# EAGLE design xen_matrix_controls_6x6 (EAGLE 9.6.0)
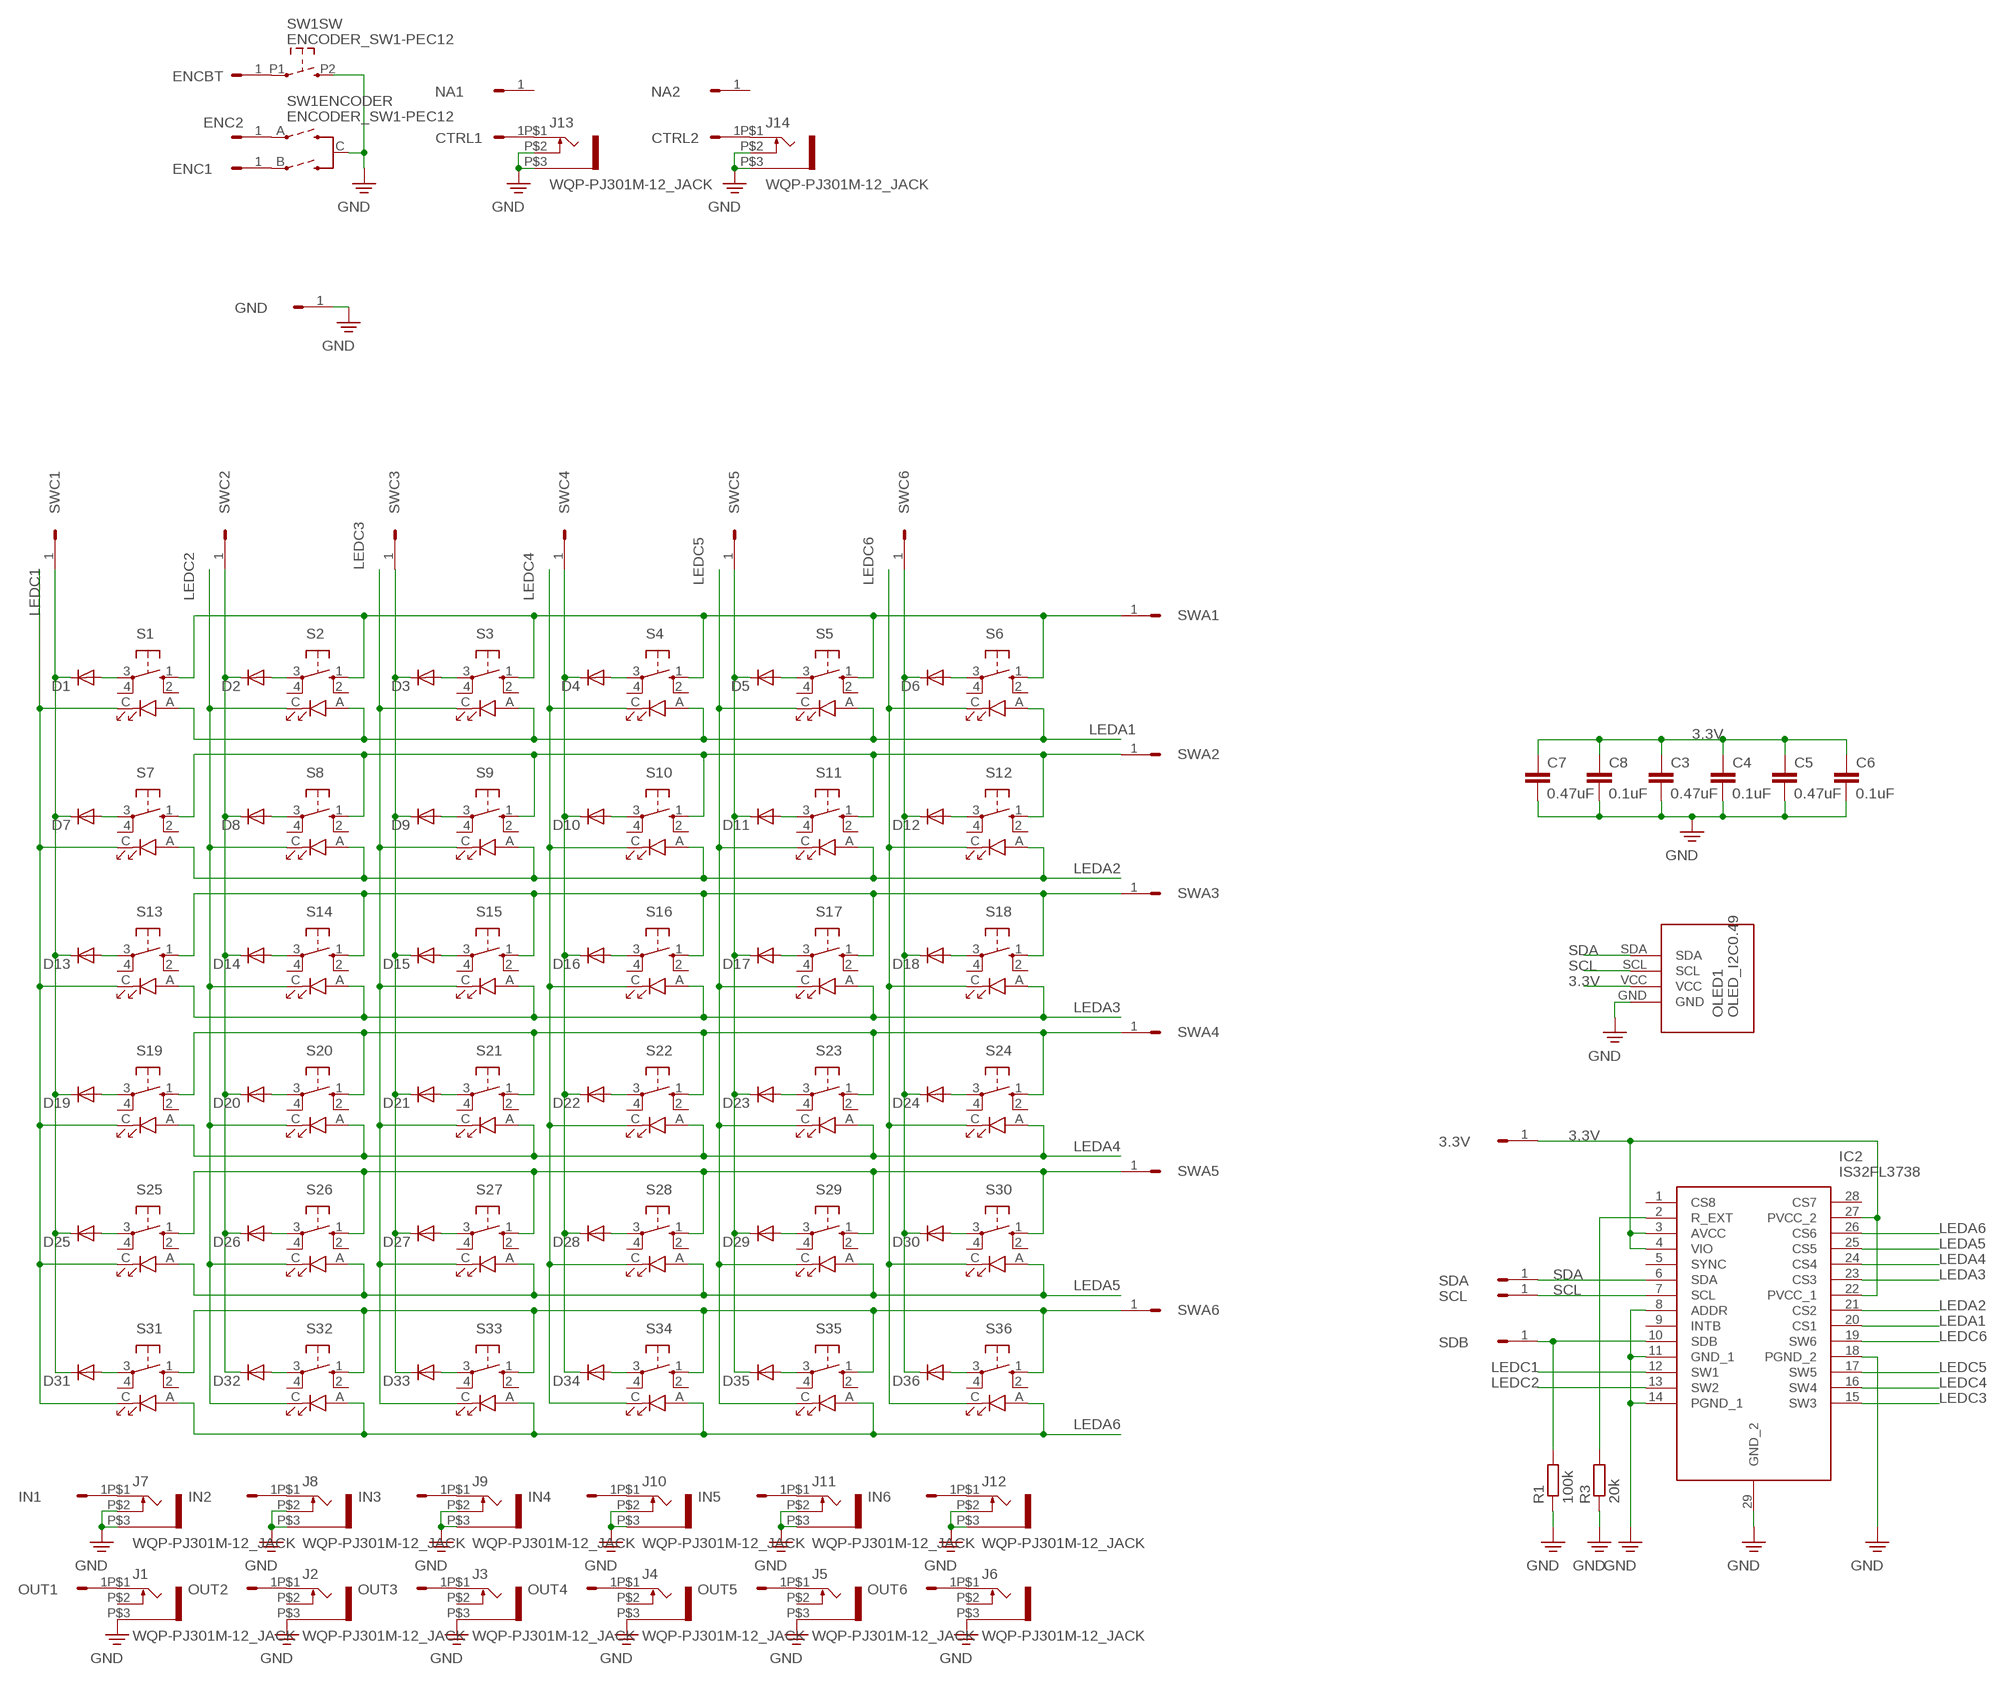
[diagram p0: schematic, sheet 1]

## Parts
3.3V  HEADER/MALE/01  [HEADER/MALE/01]
C3  0.47uF  CAPACITORC0603  [C0603]
C4  0.1uF  CAPACITORC0603  [C0603]
C5  0.47uF  CAPACITORC0603  [C0603]
C6  0.1uF  CAPACITORC0603  [C0603]
C7  0.47uF  CAPACITORC0603  [C0603]
C8  0.1uF  CAPACITORC0603  [C0603]
CTRL1  HEADER/MALE/01  [HEADER/MALE/01]
CTRL2  HEADER/MALE/01  [HEADER/MALE/01]
D1  1N4148SOD-123  [SOD-123]
D2  1N4148SOD-123  [SOD-123]
D3  1N4148SOD-123  [SOD-123]
D4  1N4148SOD-123  [SOD-123]
D5  1N4148SOD-123  [SOD-123]
D6  1N4148SOD-123  [SOD-123]
D7  1N4148SOD-123  [SOD-123]
D8  1N4148SOD-123  [SOD-123]
D9  1N4148SOD-123  [SOD-123]
D10  1N4148SOD-123  [SOD-123]
D11  1N4148SOD-123  [SOD-123]
D12  1N4148SOD-123  [SOD-123]
D13  1N4148SOD-123  [SOD-123]
D14  1N4148SOD-123  [SOD-123]
D15  1N4148SOD-123  [SOD-123]
D16  1N4148SOD-123  [SOD-123]
D17  1N4148SOD-123  [SOD-123]
D18  1N4148SOD-123  [SOD-123]
D19  1N4148SOD-123  [SOD-123]
D20  1N4148SOD-123  [SOD-123]
D21  1N4148SOD-123  [SOD-123]
D22  1N4148SOD-123  [SOD-123]
D23  1N4148SOD-123  [SOD-123]
D24  1N4148SOD-123  [SOD-123]
D25  1N4148SOD-123  [SOD-123]
D26  1N4148SOD-123  [SOD-123]
D27  1N4148SOD-123  [SOD-123]
D28  1N4148SOD-123  [SOD-123]
D29  1N4148SOD-123  [SOD-123]
D30  1N4148SOD-123  [SOD-123]
D31  1N4148SOD-123  [SOD-123]
D32  1N4148SOD-123  [SOD-123]
D33  1N4148SOD-123  [SOD-123]
D34  1N4148SOD-123  [SOD-123]
D35  1N4148SOD-123  [SOD-123]
D36  1N4148SOD-123  [SOD-123]
ENC1  HEADER/MALE/01  [HEADER/MALE/01]
ENC2  HEADER/MALE/01  [HEADER/MALE/01]
ENCBT  HEADER/MALE/01  [HEADER/MALE/01]
GND  HEADER/MALE/01  [HEADER/MALE/01]
IC2  IS32FL3738  [TSSOP29]
IN1  HEADER/MALE/01  [HEADER/MALE/01]
IN2  HEADER/MALE/01  [HEADER/MALE/01]
IN3  HEADER/MALE/01  [HEADER/MALE/01]
IN4  HEADER/MALE/01  [HEADER/MALE/01]
IN5  HEADER/MALE/01  [HEADER/MALE/01]
IN6  HEADER/MALE/01  [HEADER/MALE/01]
J1  WQP-PJ301M-12_JACK  [WQP-PJ301M-12_JACK]
J2  WQP-PJ301M-12_JACK  [WQP-PJ301M-12_JACK]
J3  WQP-PJ301M-12_JACK  [WQP-PJ301M-12_JACK]
J4  WQP-PJ301M-12_JACK  [WQP-PJ301M-12_JACK]
J5  WQP-PJ301M-12_JACK  [WQP-PJ301M-12_JACK]
J6  WQP-PJ301M-12_JACK  [WQP-PJ301M-12_JACK]
J7  WQP-PJ301M-12_JACK  [WQP-PJ301M-12_JACK]
J8  WQP-PJ301M-12_JACK  [WQP-PJ301M-12_JACK]
J9  WQP-PJ301M-12_JACK  [WQP-PJ301M-12_JACK]
J10  WQP-PJ301M-12_JACK  [WQP-PJ301M-12_JACK]
J11  WQP-PJ301M-12_JACK  [WQP-PJ301M-12_JACK]
J12  WQP-PJ301M-12_JACK  [WQP-PJ301M-12_JACK]
J13  WQP-PJ301M-12_JACK  [WQP-PJ301M-12_JACK]
J14  WQP-PJ301M-12_JACK  [WQP-PJ301M-12_JACK]
NA1  HEADER/MALE/01  [HEADER/MALE/01]
NA2  HEADER/MALE/01  [HEADER/MALE/01]
OLED1  OLED_I2C0.49  [OLEDM0.49]
OUT1  HEADER/MALE/01  [HEADER/MALE/01]
OUT2  HEADER/MALE/01  [HEADER/MALE/01]
OUT3  HEADER/MALE/01  [HEADER/MALE/01]
OUT4  HEADER/MALE/01  [HEADER/MALE/01]
OUT5  HEADER/MALE/01  [HEADER/MALE/01]
OUT6  HEADER/MALE/01  [HEADER/MALE/01]
R1  100k  RESISTOR  [R0603]
R3  20k  RESISTOR  [R0603]
S1  SW-LEDTHONK  [SW-PUSH-TACT-LED-THONK]
S2  SW-LEDTHONK  [SW-PUSH-TACT-LED-THONK]
S3  SW-LEDTHONK  [SW-PUSH-TACT-LED-THONK]
S4  SW-LEDTHONK  [SW-PUSH-TACT-LED-THONK]
S5  SW-LEDTHONK  [SW-PUSH-TACT-LED-THONK]
S6  SW-LEDTHONK  [SW-PUSH-TACT-LED-THONK]
S7  SW-LEDTHONK  [SW-PUSH-TACT-LED-THONK]
S8  SW-LEDTHONK  [SW-PUSH-TACT-LED-THONK]
S9  SW-LEDTHONK  [SW-PUSH-TACT-LED-THONK]
S10  SW-LEDTHONK  [SW-PUSH-TACT-LED-THONK]
S11  SW-LEDTHONK  [SW-PUSH-TACT-LED-THONK]
S12  SW-LEDTHONK  [SW-PUSH-TACT-LED-THONK]
S13  SW-LEDTHONK  [SW-PUSH-TACT-LED-THONK]
S14  SW-LEDTHONK  [SW-PUSH-TACT-LED-THONK]
S15  SW-LEDTHONK  [SW-PUSH-TACT-LED-THONK]
S16  SW-LEDTHONK  [SW-PUSH-TACT-LED-THONK]
S17  SW-LEDTHONK  [SW-PUSH-TACT-LED-THONK]
S18  SW-LEDTHONK  [SW-PUSH-TACT-LED-THONK]
S19  SW-LEDTHONK  [SW-PUSH-TACT-LED-THONK]
S20  SW-LEDTHONK  [SW-PUSH-TACT-LED-THONK]
S21  SW-LEDTHONK  [SW-PUSH-TACT-LED-THONK]
S22  SW-LEDTHONK  [SW-PUSH-TACT-LED-THONK]
S23  SW-LEDTHONK  [SW-PUSH-TACT-LED-THONK]
S24  SW-LEDTHONK  [SW-PUSH-TACT-LED-THONK]
S25  SW-LEDTHONK  [SW-PUSH-TACT-LED-THONK]
S26  SW-LEDTHONK  [SW-PUSH-TACT-LED-THONK]
S27  SW-LEDTHONK  [SW-PUSH-TACT-LED-THONK]
S28  SW-LEDTHONK  [SW-PUSH-TACT-LED-THONK]
S29  SW-LEDTHONK  [SW-PUSH-TACT-LED-THONK]
S30  SW-LEDTHONK  [SW-PUSH-TACT-LED-THONK]
S31  SW-LEDTHONK  [SW-PUSH-TACT-LED-THONK]
S32  SW-LEDTHONK  [SW-PUSH-TACT-LED-THONK]
S33  SW-LEDTHONK  [SW-PUSH-TACT-LED-THONK]
S34  SW-LEDTHONK  [SW-PUSH-TACT-LED-THONK]
S35  SW-LEDTHONK  [SW-PUSH-TACT-LED-THONK]
S36  SW-LEDTHONK  [SW-PUSH-TACT-LED-THONK]
SCL  HEADER/MALE/01  [HEADER/MALE/01]
SDA  HEADER/MALE/01  [HEADER/MALE/01]
SDB  HEADER/MALE/01  [HEADER/MALE/01]
SW1  ENCODER_SW1-PEC12  [PEC12_INCREMENTAL_ENCODER]
SWA1  HEADER/MALE/01  [HEADER/MALE/01]
SWA2  HEADER/MALE/01  [HEADER/MALE/01]
SWA3  HEADER/MALE/01  [HEADER/MALE/01]
SWA4  HEADER/MALE/01  [HEADER/MALE/01]
SWA5  HEADER/MALE/01  [HEADER/MALE/01]
SWA6  HEADER/MALE/01  [HEADER/MALE/01]
SWC1  HEADER/MALE/01  [HEADER/MALE/01]
SWC2  HEADER/MALE/01  [HEADER/MALE/01]
SWC3  HEADER/MALE/01  [HEADER/MALE/01]
SWC4  HEADER/MALE/01  [HEADER/MALE/01]
SWC5  HEADER/MALE/01  [HEADER/MALE/01]
SWC6  HEADER/MALE/01  [HEADER/MALE/01]

## Nets
3.3V: 3.3V.1 C3.1 C4.1 C5.1 C6.1 C7.1 C8.1 IC2.3(AVCC) IC2.4(VIO) IC2.22(PVCC_1) IC2.27(PVCC_2) OLED1.VCC
LEDA1: IC2.20(CS1) S1.A S2.A S3.A S4.A S5.A S6.A
LEDA2: IC2.21(CS2) S7.A S8.A S9.A S10.A S11.A S12.A
LEDA3: IC2.23(CS3) S13.A S14.A S15.A S16.A S17.A S18.A
LEDA4: IC2.24(CS4) S19.A S20.A S21.A S22.A S23.A S24.A
LEDA5: IC2.25(CS5) S25.A S26.A S27.A S28.A S29.A S30.A
LEDA6: IC2.26(CS6) S31.A S32.A S33.A S34.A S35.A S36.A
LEDC1: IC2.12(SW1) S1.C S7.C S13.C S19.C S25.C S31.C
LEDC2: IC2.13(SW2) S2.C S8.C S14.C S20.C S26.C S32.C
LEDC3: IC2.15(SW3) S3.C S9.C S15.C S21.C S27.C S33.C
LEDC4: IC2.16(SW4) S4.C S10.C S16.C S22.C S28.C S34.C
LEDC5: IC2.17(SW5) S5.C S11.C S17.C S23.C S29.C S35.C
LEDC6: IC2.19(SW6) S6.C S12.C S18.C S24.C S30.C S36.C
N$3: IC2.10(SDB) R1.2 SDB.1
N$6: IC2.2(R_EXT) R3.2
N$13: S25.1(S) S26.1(S) S27.1(S) S28.1(S) S29.1(S) S30.1(S) SWA5.1
N$14: S1.1(S) S2.1(S) S3.1(S) S4.1(S) S5.1(S) S6.1(S) SWA1.1
N$15: D1.A S1.3(P)
N$16: S7.1(S) S8.1(S) S9.1(S) S10.1(S) S11.1(S) S12.1(S) SWA2.1
N$17: D4.A S4.3(P)
N$18: D5.A S5.3(P)
N$19: S13.1(S) S14.1(S) S15.1(S) S16.1(S) S17.1(S) S18.1(S) SWA3.1
N$20: S19.1(S) S20.1(S) S21.1(S) S22.1(S) S23.1(S) S24.1(S) SWA4.1
N$21: D6.A S6.3(P)
N$22: S31.1(S) S32.1(S) S33.1(S) S34.1(S) S35.1(S) S36.1(S) SWA6.1
N$23: D7.A S7.3(P)
N$24: D8.A S8.3(P)
N$25: D9.A S9.3(P)
N$26: D10.A S10.3(P)
N$27: D11.A S11.3(P)
N$28: D12.A S12.3(P)
N$29: D13.A S13.3(P)
N$30: D14.A S14.3(P)
N$31: D15.A S15.3(P)
N$32: D16.A S16.3(P)
N$33: D17.A S17.3(P)
N$34: D18.A S18.3(P)
N$35: D19.A S19.3(P)
N$36: D20.A S20.3(P)
N$37: D21.A S21.3(P)
N$38: D22.A S22.3(P)
N$39: D23.A S23.3(P)
N$40: D24.A S24.3(P)
N$41: D25.A S25.3(P)
N$42: D26.A S26.3(P)
N$43: D27.A S27.3(P)
N$44: D28.A S28.3(P)
N$45: D29.A S29.3(P)
N$46: D30.A S30.3(P)
N$47: D31.A S31.3(P)
N$48: D32.A S32.3(P)
N$49: D33.A S33.3(P)
N$50: D34.A S34.3(P)
N$51: D35.A S35.3(P)
N$52: D36.A S36.3(P)
N$53: D2.A S2.3(P)
N$54: D3.A S3.3(P)
N$55: D1.C D7.C D13.C D19.C D25.C D31.C SWC1.1
N$56: D2.C D8.C D14.C D20.C D26.C D32.C SWC2.1
N$57: D3.C D9.C D15.C D21.C D27.C D33.C SWC3.1
N$58: D4.C D10.C D16.C D22.C D28.C D34.C SWC4.1
N$59: D5.C D11.C D17.C D23.C D29.C D35.C SWC5.1
N$60: D6.C D12.C D18.C D24.C D30.C D36.C SWC6.1
N$61: J2.P$1 OUT2.1
N$62: J1.P$1 OUT1.1
N$63: J3.P$1 OUT3.1
N$64: J4.P$1 OUT4.1
N$65: J5.P$1 OUT5.1
N$66: J6.P$1 OUT6.1
N$67: ENC2.1 SW1.A(ENCODER:A)
N$68: IN1.1 J7.P$1
N$69: IN2.1 J8.P$1
N$70: IN3.1 J9.P$1
N$71: IN4.1 J10.P$1
N$72: IN5.1 J11.P$1
N$73: IN6.1 J12.P$1
N$74: CTRL1.1 J13.P$1
N$75: CTRL2.1 J14.P$1
N$76: ENC1.1 SW1.B(ENCODER:B)
N$78: ENCBT.1 SW1.P1
PE: C3.2 C4.2 C5.2 C6.2 C7.2 C8.2 GND.1 IC2.8(ADDR) IC2.11(GND_1) IC2.14(PGND_1) IC2.18(PGND_2) IC2.29(GND_2) J1.P$3 J2.P$3 J3.P$3 J4.P$3 J5.P$3 J6.P$3 J7.P$2 J7.P$3 J8.P$2 J8.P$3 J9.P$2 J9.P$3 J10.P$2 J10.P$3 J11.P$2 J11.P$3 J12.P$2 J12.P$3 J13.P$2 J13.P$3 J14.P$2 J14.P$3 OLED1.GND R1.1 R3.1 SW1.C(ENCODER:C) SW1.P2 ; supply symbol labelled GND
SCL: IC2.7(SCL) OLED1.SCL SCL.1
SDA: IC2.6(SDA) OLED1.SDA SDA.1
Unconnected: IC2.1(CS8) IC2.5(SYNC) IC2.9(INTB) IC2.28(CS7) J1.P$2 J2.P$2 J3.P$2 J4.P$2 J5.P$2 J6.P$2 NA1.1 NA2.1 S1.2(S1) S1.4(P1) S2.2(S1) S2.4(P1) S3.2(S1) S3.4(P1) S4.2(S1) S4.4(P1) S5.2(S1) S5.4(P1) S6.2(S1) S6.4(P1) S7.2(S1) S7.4(P1) S8.2(S1) S8.4(P1) S9.2(S1) S9.4(P1) S10.2(S1) S10.4(P1) S11.2(S1) S11.4(P1) S12.2(S1) S12.4(P1) S13.2(S1) S13.4(P1) S14.2(S1) S14.4(P1) S15.2(S1) S15.4(P1) S16.2(S1) S16.4(P1) S17.2(S1) S17.4(P1) S18.2(S1) S18.4(P1) S19.2(S1) S19.4(P1) S20.2(S1) S20.4(P1) S21.2(S1) S21.4(P1) S22.2(S1) S22.4(P1) S23.2(S1) S23.4(P1) S24.2(S1) S24.4(P1) S25.2(S1) S25.4(P1) S26.2(S1) S26.4(P1) S27.2(S1) S27.4(P1) S28.2(S1) S28.4(P1) S29.2(S1) S29.4(P1) S30.2(S1) S30.4(P1) S31.2(S1) S31.4(P1) S32.2(S1) S32.4(P1) S33.2(S1) S33.4(P1) S34.2(S1) S34.4(P1) S35.2(S1) S35.4(P1) S36.2(S1) S36.4(P1)

## Library data of the parts
3.3V CTRL1 CTRL2 ENC1 ENC2 ENCBT GND IN1-IN6 NA1 NA2 OUT1-OUT6 SCL SDA SDB SWA1-SWA6 SWC1-SWC6 = connectors:HEADER/MALE/01; SPICEPREFIX: X
C3-C8 = capacitors:CAPACITOR: CAPACITOR, European symbol
D1-D36 = transistors:1N4148: DIODE high speed (Philips)
IC2 = ic_digital:IS32FL3738: IC LED DRIVER 6X8 28TSSOP Source: Datasheet <http://www.issi.com/WW/pdf/IS32FL3738.pdf>; DESCRIPTION: IC LED DRIVER 6X8 28TSSOP; HEIGHT: 1.2mm; MANUFACTURER_NAME: ISSI, Integrated Silicon Solution Inc; MANUFACTURER_PART_NUMBER: IS32FL3738-ZLA3-TR
J1-J14 = controls:WQP-PJ301M-12_JACK
OLED1 = display:OLED_I2C
R1 R3 = resistors:RESISTOR: RESISTOR, European symbol
S1-S36 = controls:SW-LED: Illuminated Switch
SW1 = controls:ENCODER_SW1: Incremental Encoder with push switch

## Board
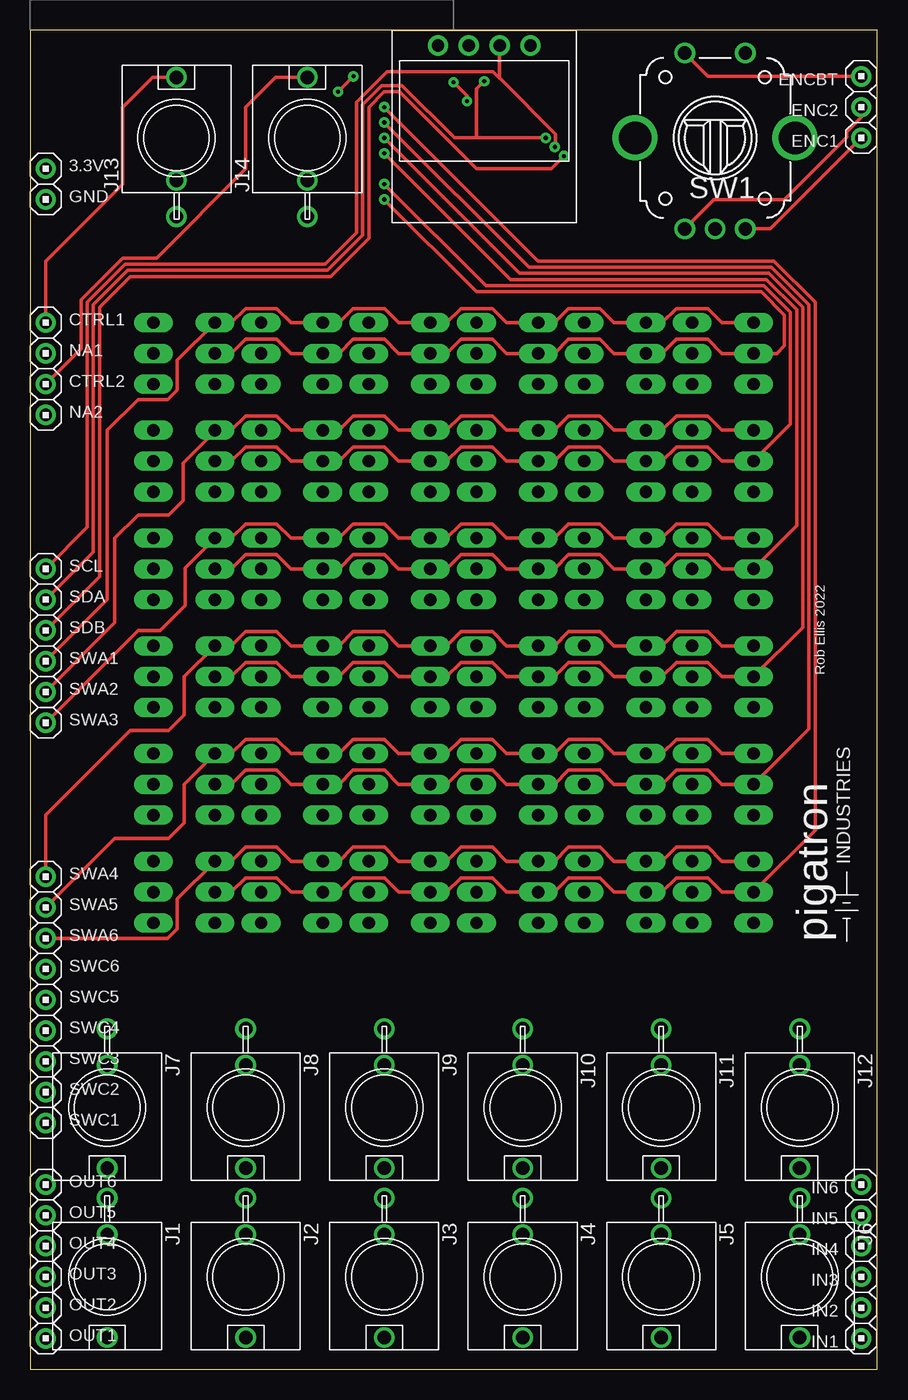
[diagram p1: board, top side]
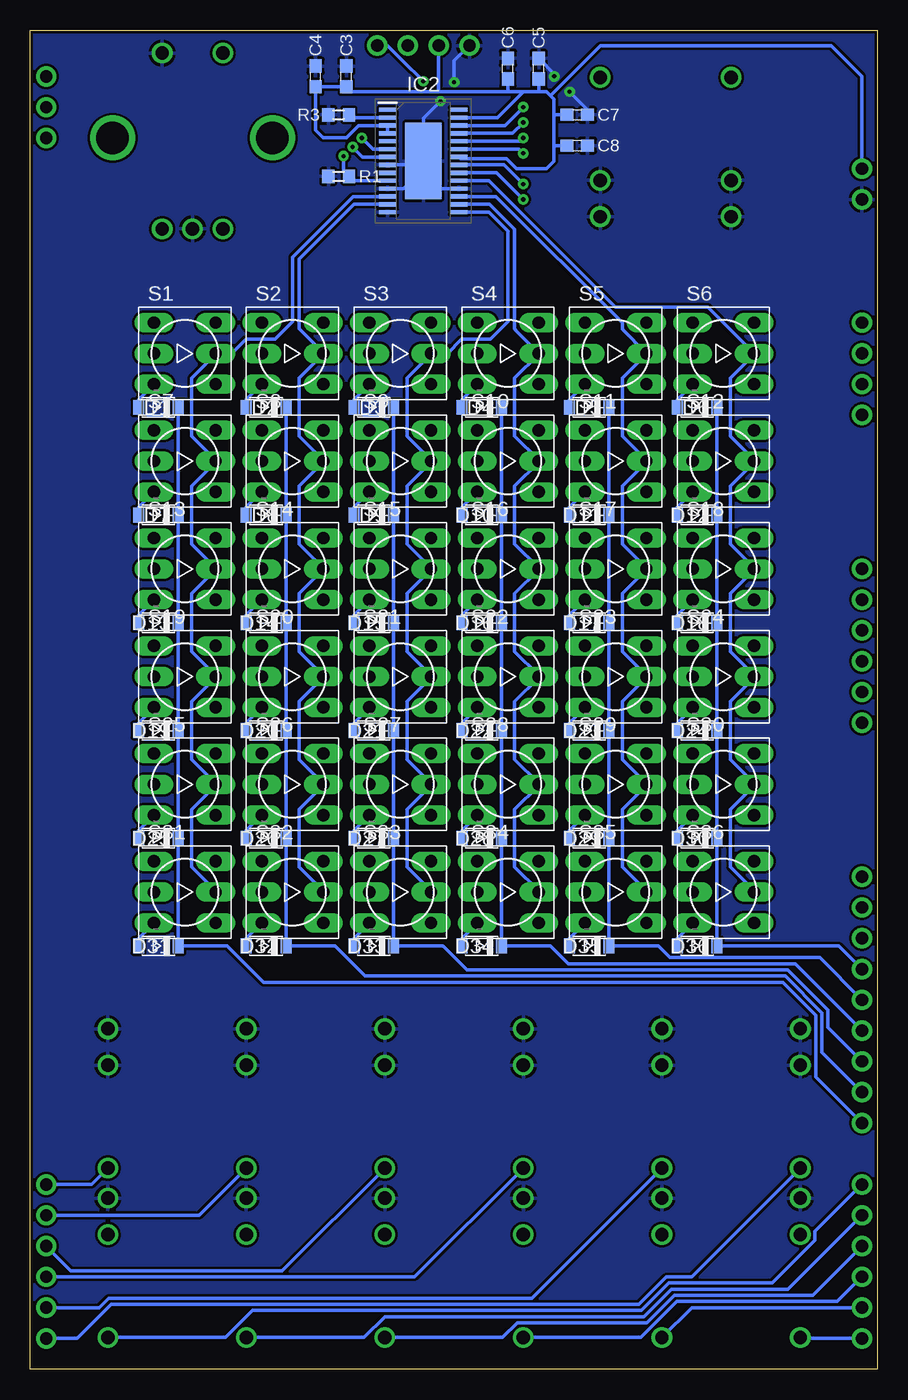
[diagram p2: board, bottom side, seen from below]

Size 69.9 x 110.48 mm. Coordinates in mm from the lower left corner, seen from the top.
Outline: 0,0 69.9,0 69.9,110.48 0,110.48 0,0
Copper layers (1*16): Top 0.0356mm / dielectric 1.5011mm / Bottom 0.0356mm
Design rules "pigatron *": minimum track width 8mil, minimum drill 13mil, track to track 8mil, track to pad 8mil, pad to pad 8mil, via to via 8mil, smd to smd 6mil, copper to edge 10mil, drill to drill 10mil, minimum pad ring 12mil, minimum via ring 10mil, stop-mask expansion 4mil, vias tented up to drill 0mil, thermal gap 10mil

### Footprints (pad centres in the part's own frame; a part is rotated, then mirrored left to right if it is on the bottom)
HEADER/MALE/01 = drill 1.016 pad 1.676: 1 0,0
C0603 = smd 1.1 x 1: 1 -0.85,0; 2 0.85,0
SOD-123 = smd 0.91 x 1.22: A 1.635,0; C -1.635,0
TSSOP29 = smd 1.4 x 0.35: 1 -2.938,4.225; 2 -2.938,3.575; 3 -2.938,2.925; 4 -2.938,2.275; 5 -2.938,1.625; 6 -2.938,0.975; 7 -2.938,0.325; 8 -2.938,-0.325; 9 -2.938,-0.975; 10 -2.938,-1.625; 11 -2.938,-2.275; 12 -2.938,-2.925; 13 -2.938,-3.575; 14 -2.938,-4.225; 15 2.938,-4.225; 16 2.938,-3.575; 17 2.938,-2.925; 18 2.938,-2.275; 19 2.938,-1.625; 20 2.938,-0.975; 21 2.938,-0.325; 22 2.938,0.325; 23 2.938,0.975; 24 2.938,1.625; 25 2.938,2.275; 26 2.938,2.925; 27 2.938,3.575; 28 2.938,4.225 | smd 3 x 6.3: 29 0,0
WQP-PJ301M-12_JACK = drill 1.1 pad 1.676: P$1 0,5; P$2 0,-3.5; P$3 0,-6.5
OLEDM0.49 = drill 1.016 pad 1.676: GND -3.81,-1.27; SCL 1.27,-1.27; SDA 3.81,-1.27; VCC -1.27,-1.27
R0603 = smd 1 x 1.1: 1 -0.85,0; 2 0.85,0
SW-PUSH-TACT-LED-THONK = drill 1.016 long: 1 -2.54,2.54; 2 2.54,2.54; 3 -2.54,-2.54; 4 2.54,-2.54; A -2.54,0; C 2.54,0
PEC12_INCREMENTAL_ENCODER = drill 1.1 pad 1.676: A -2.5,-7.5; B 2.5,-7.5; C 0,-7.5; P1 -2.5,7; P2 2.5,7 | drill 2.692: GND@1 -6.6,0; GND@2 6.6,0

### Placement (x,y rotation side)
3.3V  1.27,99.06 0 top
C3  43.81,106.68 90 bottom
C4  46.35,106.68 90 bottom
C5  27.94,107.31 90 bottom
C6  30.48,107.31 90 bottom
C7  24.77,103.5 0 bottom
C8  24.77,100.97 0 bottom
CTRL1  1.27,86.36 0 top
CTRL2  1.27,81.28 0 top
D1  59.33,79.38 180 bottom
D2  50.44,79.38 180 bottom
D3  41.55,79.38 180 bottom
D4  32.66,79.38 180 bottom
D5  23.77,79.38 180 bottom
D6  14.88,79.38 180 bottom
D7  59.33,70.48 180 bottom
D8  50.44,70.48 180 bottom
D9  41.55,70.48 180 bottom
D10  32.66,70.48 180 bottom
D11  23.77,70.48 180 bottom
D12  14.88,70.48 180 bottom
D13  59.33,61.59 180 bottom
D14  50.44,61.59 180 bottom
D15  41.55,61.59 180 bottom
D16  32.66,61.59 180 bottom
D17  23.77,61.59 180 bottom
D18  14.88,61.59 180 bottom
D19  59.33,52.7 180 bottom
D20  50.44,52.7 180 bottom
D21  41.55,52.7 180 bottom
D22  32.66,52.7 180 bottom
D23  23.77,52.7 180 bottom
D24  14.88,52.7 180 bottom
D25  59.33,43.81 180 bottom
D26  50.44,43.81 180 bottom
D27  41.55,43.81 180 bottom
D28  32.66,43.81 180 bottom
D29  23.77,43.81 180 bottom
D30  14.88,43.81 180 bottom
D31  59.33,34.92 180 bottom
D32  50.44,34.92 180 bottom
D33  41.55,34.92 180 bottom
D34  32.66,34.92 180 bottom
D35  23.77,34.92 180 bottom
D36  14.88,34.92 180 bottom
ENC1  68.58,101.6 180 top
ENC2  68.58,104.14 180 top
ENCBT  68.58,106.68 180 top
GND  1.27,96.52 0 top
IC2  37.47,99.69 0 bottom
IN1  68.58,2.54 180 top
IN2  68.58,5.08 180 top
IN3  68.58,7.62 180 top
IN4  68.58,10.16 180 top
IN5  68.58,12.7 180 top
IN6  68.58,15.24 180 top
J1  6.35,7.62 180 top
J2  17.78,7.62 180 top
J3  29.21,7.62 180 top
J4  40.64,7.62 180 top
J5  52.07,7.62 180 top
J6  63.5,7.62 180 top
J7  6.35,21.59 180 top
J8  17.78,21.59 180 top
J9  29.21,21.59 180 top
J10  40.64,21.59 180 top
J11  52.07,21.59 180 top
J12  63.5,21.59 180 top
J13  12.06,101.6 0 top
J14  22.86,101.6 0 top
NA1  1.27,83.82 0 top
NA2  1.27,78.74 0 top
OLED1  37.47,110.49 0 top
OUT1  1.27,2.54 0 top
OUT2  1.27,5.08 0 top
OUT3  1.27,7.62 0 top
OUT4  1.27,10.16 0 top
OUT5  1.27,12.7 0 top
OUT6  1.27,15.24 0 top
R1  44.45,98.42 0 bottom
R3  44.45,103.5 0 bottom
S1  57.15,83.82 0 bottom
S2  48.26,83.82 0 bottom
S3  39.37,83.82 0 bottom
S4  30.48,83.82 0 bottom
S5  21.59,83.82 0 bottom
S6  12.7,83.82 0 bottom
S7  57.15,74.93 0 bottom
S8  48.26,74.93 0 bottom
S9  39.37,74.93 0 bottom
S10  30.48,74.93 0 bottom
S11  21.59,74.93 0 bottom
S12  12.7,74.93 0 bottom
S13  57.15,66.04 0 bottom
S14  48.26,66.04 0 bottom
S15  39.37,66.04 0 bottom
S16  30.48,66.04 0 bottom
S17  21.59,66.04 0 bottom
S18  12.7,66.04 0 bottom
S19  57.15,57.15 0 bottom
S20  48.26,57.15 0 bottom
S21  39.37,57.15 0 bottom
S22  30.48,57.15 0 bottom
S23  21.59,57.15 0 bottom
S24  12.7,57.15 0 bottom
S25  57.15,48.26 0 bottom
S26  48.26,48.26 0 bottom
S27  39.37,48.26 0 bottom
S28  30.48,48.26 0 bottom
S29  21.59,48.26 0 bottom
S30  12.7,48.26 0 bottom
S31  57.15,39.37 0 bottom
S32  48.26,39.37 0 bottom
S33  39.37,39.37 0 bottom
S34  30.48,39.37 0 bottom
S35  21.59,39.37 0 bottom
S36  12.7,39.37 0 bottom
SCL  1.27,66.04 0 top
SDA  1.27,63.5 0 top
SDB  1.27,60.96 0 top
SW1  56.52,101.6 0 top
SWA1  1.27,58.42 0 top
SWA2  1.27,55.88 0 top
SWA3  1.27,53.34 0 top
SWA4  1.27,40.64 0 top
SWA5  1.27,38.1 0 top
SWA6  1.27,35.56 0 top
SWC1  1.27,20.32 0 top
SWC2  1.27,22.86 0 top
SWC3  1.27,25.4 0 top
SWC4  1.27,27.94 0 top
SWC5  1.27,30.48 0 top
SWC6  1.27,33.02 0 top
U$1  [PIGATRON-LOGO]  65.79,44.2 90 top

### Tracks (layer width: path | path; a pad name or v marks a point on that pad's centre or on a via)
3.3V
  Bottom 0.305: 26.99,105.09 27.3,105.41 27.94,105.41 | 26.99,105.09 26.67,104.78 26.67,103.5 | IC2.27 31.35,103.27 29.21,105.41 | 26.67,100.97 26.67,99.69 27.3,99.06 29.76,99.06 30.6,99.9 34.41,99.9 IC2.22 | 26.67,100.97 26.67,103.5 | 27.94,105.41 29.21,105.41 | 29.21,105.41 30.48,105.41 | IC2.4 IC2.3 42.8,102.62 43.81,101.6 45.72,101.6 46.35,102.23 C4.1 C3.1 43.4,105.41 36.2,105.41 | C6.1 30.48,105.41 | C5.1 27.94,105.41 | C7.1 26.67,103.5 | C8.1 26.67,100.97 | 30.48,105.41 36.2,105.41 | 3.3V.1 1.27,106.68 3.81,109.22 22.86,109.22 26.99,105.09 | OLED1.VCC 36.2,105.41
LEDA1  (via drill 0.35)
  Top 0.305: S6.A 16.59,83.82 17.75,84.99 20.35,84.99 21.52,83.82 S5.A 25.48,83.82 26.64,84.99 29.24,84.99 30.41,83.82 S4.A 34.37,83.82 35.53,84.99 38.13,84.99 39.3,83.82 S3.A 43.26,83.82 44.42,84.99 47.02,84.99 48.19,83.82 S2.A 52.15,83.82 53.31,84.99 55.91,84.99 57.08,83.82 S1.A 61.59,83.82 62.23,84.45 62.23,87 60.33,88.9 36.83,88.9 v29.21,96.52
  Bottom 0.305: v29.21,96.52 31.41,98.72 IC2.20
LEDA2  (via drill 0.35)
  Top 0.305: S12.A 16.59,74.93 17.75,76.1 20.35,76.1 21.52,74.93 S11.A 25.48,74.93 26.64,76.1 29.24,76.1 30.41,74.93 S10.A 34.37,74.93 35.53,76.1 38.13,76.1 39.3,74.93 S9.A 43.26,74.93 44.42,76.1 47.02,76.1 48.19,74.93 S8.A 52.15,74.93 53.31,76.1 55.91,76.1 57.08,74.93 S7.A 62.74,77.98 62.74,87.2 60.53,89.41 37.59,89.41 v29.21,97.79
  Bottom 0.305: IC2.21 30.79,99.37 v29.21,97.79
LEDA3  (via drill 0.35)
  Top 0.305: S18.A 16.59,66.04 17.75,67.21 20.35,67.21 21.52,66.04 S17.A 25.48,66.04 26.64,67.21 29.24,67.21 30.41,66.04 S16.A 34.37,66.04 35.53,67.21 38.13,67.21 39.3,66.04 S15.A 43.26,66.04 44.42,67.21 47.02,67.21 48.19,66.04 S14.A 52.15,66.04 53.31,67.21 55.91,67.21 57.08,66.04 S13.A 63.25,69.6 63.25,87.42 60.75,89.92 39.62,89.92 v29.21,100.33
  Bottom 0.305: v29.21,100.33 29.55,100.67 IC2.23
LEDA4  (via drill 0.35)
  Top 0.305: S24.A 16.59,57.15 17.75,58.32 20.35,58.32 21.52,57.15 S23.A 25.48,57.15 26.64,58.32 29.24,58.32 30.41,57.15 S22.A 34.37,57.15 35.53,58.32 38.13,58.32 39.3,57.15 S21.A 43.26,57.15 44.42,58.32 47.02,58.32 48.19,57.15 S20.A 52.15,57.15 53.31,58.32 55.91,58.32 57.08,57.15 S19.A 63.75,61.21 63.75,87.63 60.96,90.42 40.39,90.42 v29.21,101.6
  Bottom 0.305: IC2.24 29.49,101.32 v29.21,101.6
LEDA5  (via drill 0.35)
  Top 0.305: S30.A 16.59,48.26 17.75,49.43 20.35,49.43 21.52,48.26 S29.A 25.48,48.26 26.64,49.43 29.24,49.43 30.41,48.26 S28.A 34.37,48.26 35.53,49.43 38.13,49.43 39.3,48.26 S27.A 43.26,48.26 44.42,49.43 47.02,49.43 48.19,48.26 S26.A 52.15,48.26 53.31,49.43 55.91,49.43 57.08,48.26 S25.A 64.26,52.83 64.26,87.84 61.17,90.93 41.15,90.93 v29.21,102.87
  Bottom 0.305: IC2.25 30.11,101.97 v29.21,102.87
LEDA6  (via drill 0.35)
  Top 0.305: S36.A 16.59,39.37 17.75,40.54 20.35,40.54 21.52,39.37 S35.A 25.48,39.37 26.64,40.54 29.24,40.54 30.41,39.37 S34.A 34.37,39.37 35.53,40.54 38.13,40.54 39.3,39.37 S33.A 43.26,39.37 44.42,40.54 47.02,40.54 48.19,39.37 S32.A 52.15,39.37 53.31,40.54 55.91,40.54 57.08,39.37 S31.A 64.77,44.45 64.77,88.05 61.38,91.44 41.91,91.44 v29.21,104.14
  Bottom 0.305: v29.21,104.14 30.73,102.62 IC2.26
LEDC1
  Bottom 0.305: S31.C 54.61,39.45 56.59,41.43 56.59,46.2 54.61,48.19 S25.C 54.61,48.34 56.59,50.32 56.59,55.09 54.61,57.08 S19.C 54.61,57.23 56.59,59.21 56.59,63.98 54.61,65.97 S13.C 54.61,66.11 56.59,68.1 56.59,72.87 54.61,74.86 S7.C 54.61,75 56.59,76.99 56.59,81.76 54.61,83.75 S1.C 53.27,83.82 52.1,84.99 49.71,84.99 48.26,86.44 48.26,91.76 43.25,96.77 IC2.12
LEDC2
  Bottom 0.305: S32.C 45.72,39.45 47.7,41.43 47.7,46.2 45.72,48.19 S26.C 45.72,48.34 47.7,50.32 47.7,55.09 45.72,57.08 S20.C 45.72,57.23 47.7,59.21 47.7,63.98 45.72,65.97 S14.C 45.72,66.11 47.7,68.1 47.7,72.87 45.72,74.86 S8.C 45.72,75 47.7,76.99 47.7,81.76 45.72,83.75 S2.C 45.72,83.89 47.7,85.88 47.7,91.6 43.18,96.12 IC2.13
LEDC3
  Bottom 0.305: S33.C 36.83,39.45 38.81,41.43 38.81,46.2 36.83,48.19 S27.C 36.83,48.34 38.81,50.32 38.81,55.09 36.83,57.08 S21.C 36.83,57.23 38.81,59.21 38.81,63.98 36.83,65.97 S15.C 36.83,66.11 38.81,68.1 38.81,72.87 36.83,74.86 S9.C 36.83,75 38.81,76.99 38.81,81.76 36.83,83.75 S3.C 35.48,83.82 34.32,84.99 31.93,84.99 30.48,86.44 30.48,93.9 32.05,95.47 IC2.15
LEDC4
  Bottom 0.305: S34.C 27.94,39.45 29.92,41.43 29.92,46.2 27.94,48.19 S28.C 27.94,48.34 29.92,50.32 29.92,55.09 27.94,57.08 S22.C 27.94,57.23 29.92,59.21 29.92,63.98 27.94,65.97 S16.C 27.94,66.11 29.92,68.1 29.92,72.87 27.94,74.86 S10.C 27.94,75 29.92,76.99 29.92,81.76 27.94,83.75 S4.C 29.84,85.72 29.84,85.8 29.92,85.88 29.92,94.06 31.98,96.12 IC2.16
LEDC5
  Bottom 0.305: S35.C 19.05,39.45 21.03,41.43 21.03,46.2 19.05,48.19 S29.C 19.05,48.34 21.03,50.32 21.03,55.09 19.05,57.08 S23.C 19.05,57.23 21.03,59.21 21.03,63.98 19.05,65.97 S17.C 19.05,66.11 21.03,68.1 21.03,72.87 19.05,74.86 S11.C 19.05,75 21.03,76.99 21.03,81.76 19.05,83.75 S5.C 21.03,85.8 21.03,86.35 31.45,96.77 IC2.17
LEDC6
  Bottom 0.305: S36.C 10.16,39.45 12.14,41.43 12.14,46.2 10.16,48.19 S30.C 10.16,48.34 12.14,50.32 12.14,55.09 10.16,57.08 S24.C 10.16,57.23 12.14,59.21 12.14,63.98 10.16,65.97 S18.C 10.16,66.11 12.14,68.1 12.14,72.87 10.16,74.86 S12.C 10.16,75 12.14,76.99 12.14,81.76 10.16,83.75 S6.C 13.97,87.63 21.59,87.63 32.03,98.07 IC2.19
N$3  (via drill 0.35)
  Top 0.305: SDB.1 5.71,65.41 5.71,87.63 8.26,90.17 24.77,90.17 27.94,93.34 27.94,104.14 29.21,105.41 30.48,105.41 36.83,99.06 43.01,99.06 v44.05,100.1
  Bottom 0.305: IC2.10 43.24,98.07 R1.2 44.05,98.87 v44.05,100.1
N$6
  Bottom 0.305: IC2.2 43.37,103.27 R3.2
N$13
  Top 0.305: S25.1 57.08,50.8 55.91,51.97 53.31,51.97 52.15,50.8 S26.1 48.19,50.8 47.02,51.97 44.42,51.97 43.26,50.8 S27.1 39.3,50.8 38.13,51.97 35.53,51.97 34.37,50.8 S28.1 30.41,50.8 29.24,51.97 26.64,51.97 25.48,50.8 S29.1 21.52,50.8 20.35,51.97 17.75,51.97 16.59,50.8 S30.1 12.7,48.26 12.7,45.09 11.43,43.81 6.99,43.81 SWA5.1
N$14
  Top 0.305: S1.1 57.08,86.36 55.91,87.53 53.31,87.53 52.15,86.36 S2.1 48.19,86.36 47.02,87.53 44.42,87.53 43.26,86.36 S3.1 39.3,86.36 38.13,87.53 35.53,87.53 34.37,86.36 S4.1 30.41,86.36 29.24,87.53 26.64,87.53 25.48,86.36 S5.1 21.52,86.36 20.35,87.53 17.75,87.53 16.59,86.36 S6.1 12.14,83.26 12.14,80.8 11.36,80.01 8.89,80.01 6.35,77.47 6.35,63.5 SWA1.1
N$15
  Bottom 0.305: S1.3 60.96,80.01 D1.A
N$16
  Top 0.305: S7.1 57.08,77.47 55.91,78.64 53.31,78.64 52.15,77.47 S8.1 48.19,77.47 47.02,78.64 44.42,78.64 43.26,77.47 S9.1 39.3,77.47 38.13,78.64 35.53,78.64 34.37,77.47 S10.1 30.41,77.47 29.24,78.64 26.64,78.64 25.48,77.47 S11.1 21.52,77.47 20.35,78.64 17.75,78.64 16.59,77.47 S12.1 15.24,77.39 12.62,74.78 12.62,71.68 11.43,70.48 8.89,70.48 6.99,68.58 6.99,61.59 SWA2.1
N$17
  Bottom 0.305: S4.3 34.29,80.01 D4.A
N$18
  Bottom 0.305: S5.3 25.4,80.01 D5.A
N$19
  Top 0.305: S13.1 57.08,68.58 55.91,69.75 53.31,69.75 52.15,68.58 S14.1 48.19,68.58 47.02,69.75 44.42,69.75 43.26,68.58 S15.1 39.3,68.58 38.13,69.75 35.53,69.75 34.37,68.58 S16.1 30.41,68.58 29.24,69.75 26.64,69.75 25.48,68.58 S17.1 21.52,68.58 20.35,69.75 17.75,69.75 16.59,68.58 S18.1 12.78,66.12 12.78,63.02 10.72,60.96 8.89,60.96 SWA3.1
N$20
  Top 0.305: S19.1 57.08,59.69 55.91,60.86 53.31,60.86 52.15,59.69 S20.1 48.19,59.69 47.02,60.86 44.42,60.86 43.26,59.69 S21.1 39.3,59.69 38.13,60.86 35.53,60.86 34.37,59.69 S22.1 30.41,59.69 29.24,60.86 26.64,60.86 25.48,59.69 S23.1 21.52,59.69 20.35,60.86 17.75,60.86 16.59,59.69 S24.1 12.7,57.15 12.7,53.98 11.43,52.7 8.26,52.7 1.27,45.72 SWA4.1
N$21
  Bottom 0.305: S6.3 16.51,80.01 D6.A
N$22
  Top 0.305: S31.1 57.08,41.91 55.91,43.08 53.31,43.08 52.15,41.91 S32.1 48.19,41.91 47.02,43.08 44.42,43.08 43.26,41.91 S33.1 39.3,41.91 38.13,43.08 35.53,43.08 34.37,41.91 S34.1 30.41,41.91 29.24,43.08 26.64,43.08 25.48,41.91 S35.1 21.52,41.91 20.35,43.08 17.75,43.08 16.59,41.91 S36.1 12.14,38.81 12.14,36.35 11.36,35.56 SWA6.1
N$23
  Bottom 0.305: S7.3 60.96,71.12 D7.A
N$24
  Bottom 0.305: S8.3 52.07,71.12 D8.A
N$25
  Bottom 0.305: S9.3 43.18,71.12 D9.A
N$26
  Bottom 0.305: S10.3 34.29,71.12 D10.A
N$27
  Bottom 0.305: S11.3 25.4,71.12 D11.A
N$28
  Bottom 0.305: S12.3 16.51,71.12 D12.A
N$29
  Bottom 0.305: S13.3 60.96,62.23 D13.A
N$30
  Bottom 0.305: S14.3 52.07,62.23 D14.A
N$31
  Bottom 0.305: S15.3 43.18,62.23 D15.A
N$32
  Bottom 0.305: S16.3 34.29,62.23 D16.A
N$33
  Bottom 0.305: S17.3 25.4,62.23 D17.A
N$34
  Bottom 0.305: S18.3 16.51,62.23 D18.A
N$35
  Bottom 0.305: S19.3 60.96,53.34 D19.A
N$36
  Bottom 0.305: S20.3 52.07,53.34 D20.A
N$37
  Bottom 0.305: S21.3 43.18,53.34 D21.A
N$38
  Bottom 0.305: S22.3 34.29,53.34 D22.A
N$39
  Bottom 0.305: S23.3 25.4,53.34 D23.A
N$40
  Bottom 0.305: S24.3 16.51,53.34 D24.A
N$41
  Bottom 0.305: S25.3 60.96,44.45 D25.A
N$42
  Bottom 0.305: S26.3 52.07,44.45 D26.A
N$43
  Bottom 0.305: S27.3 43.18,44.45 D27.A
N$44
  Bottom 0.305: S28.3 34.29,44.45 D28.A
N$45
  Bottom 0.305: S29.3 25.4,44.45 D29.A
N$46
  Bottom 0.305: S30.3 16.51,44.45 D30.A
N$47
  Bottom 0.305: S31.3 60.96,35.56 D31.A
N$48
  Bottom 0.305: S32.3 52.07,35.56 D32.A
N$49
  Bottom 0.305: S33.3 43.18,35.56 D33.A
N$50
  Bottom 0.305: S34.3 34.29,35.56 D34.A
N$51
  Bottom 0.305: S35.3 25.4,35.56 D35.A
N$52
  Bottom 0.305: S36.3 16.51,35.56 D36.A
N$53
  Bottom 0.305: S2.3 52.07,80.01 D2.A
N$54
  Bottom 0.305: S3.3 43.18,80.01 D3.A
N$55
  Bottom 0.305: D1.C D7.C D13.C D19.C D25.C D31.C 53.64,34.92 50.64,31.93 7.8,31.93 5.08,29.21 5.08,24.13 SWC1.1
N$56
  Bottom 0.305: D2.C D8.C D14.C D20.C D26.C D32.C 44.75,34.92 42.26,32.44 7.59,32.44 4.57,29.42 4.57,26.16 SWC2.1
N$57
  Bottom 0.305: D3.C D9.C D15.C D21.C D27.C D33.C 35.86,34.92 33.88,32.94 10.16,32.94 10.14,32.94 7.38,32.94 4.06,29.63 4.06,28.19 SWC3.1
N$58
  Bottom 0.305: D4.C D10.C D16.C D22.C D28.C D34.C 26.97,34.92 25.49,33.45 6.78,33.45 SWC4.1
N$59
  Bottom 0.305: D5.C D11.C D17.C D23.C D29.C D35.C 18.08,34.92 17.11,33.96 4.75,33.96 SWC5.1
N$60
  Bottom 0.305: D6.C D12.C D18.C D24.C D30.C D36.C 3.17,34.92 SWC6.1
N$61
  Bottom 0.305: OUT2.1 15.32,5.08 J2.P$1
N$62
  Bottom 0.305: OUT1.1 6.27,2.54 J1.P$1
N$63
  Bottom 0.305: OUT3.1 3.3,5.59 16.52,5.59 19.49,2.62 J3.P$1
N$64
  Bottom 0.305: J4.P$1 30.92,2.62 29.71,3.83 19.03,3.83 16.76,6.1 5.33,6.1 OUT4.1
N$65
  Bottom 0.305: J5.P$1 42.35,2.62 40.63,4.34 19.24,4.34 16.97,6.6 7.37,6.6 OUT5.1
N$66
  Bottom 0.305: J6.P$1 53.78,2.62 51.55,4.85 19.45,4.85 17.18,7.11 8.65,7.11 5.14,10.62 5.14,11.37 OUT6.1
N$67
  Top 0.305: SW1.A 56.44,96.52 62.23,96.52 67.39,101.68 67.39,102.09 68.58,103.29 ENC2.1
N$68
  Bottom 0.305: IN1.1 66.04,2.54 63.23,5.35 19.66,5.35 17.39,7.62 15.32,7.62 J7.P$1
N$69
  Bottom 0.305: IN2.1 64.22,5.08 63.44,5.86 28.51,5.86 J8.P$1
N$70
  Bottom 0.305: IN3.1 38.18,7.62 J9.P$1
N$71
  Bottom 0.305: IN4.1 66.55,8.13 49.1,8.13 J10.P$1
N$72
  Bottom 0.305: IN5.1 55.96,12.7 J11.P$1
N$73
  Bottom 0.305: IN6.1 64.85,15.24 J12.P$1
N$74
  Top 0.305: CTRL1.1 1.27,91.44 7.62,97.79 7.62,104.14 10.08,106.6 J13.P$1
N$75
  Top 0.305: CTRL2.1 4.19,84.2 4.19,88.26 7.62,91.69 10.41,91.69 17.78,99.06 17.78,104.14 20.24,106.6 J14.P$1
N$76
  Top 0.305: SW1.B 61.08,94.1 ENC1.1
N$78
  Top 0.305: SW1.P1 55.94,106.68 ENCBT.1
PE  (via drill 0.35)
  Top 0.305: v25.4,105.41 v26.67,106.68 | v34.92,106.19 36.05,105.07 v36.05,104.62
  Bottom 0.305: IC2.18 36.46,97.42 37.47,98.42 37.47,99.06 | 37.47,99.06 IC2.29 | IC2.8 37.79,99.37 IC2.29 | IC2.11 39.1,97.42 37.47,99.06 | C7.2 23.91,103.92 v25.4,105.41 | v26.67,106.68 26.67,106.89 C5.2 | OLED1.GND 34.92,107.95 v34.92,106.19 | v36.05,104.62 37.47,103.21 IC2.29
  pour Bottom: 0,110.49 69.85,110.49 69.85,0 0,0
SCL  (via drill 0.35)
  Top 0.305: v43.3,100.85 43.3,101.24 43.33,101.28 43.33,101.92 38.83,106.43 38.73,106.52 | 38.73,106.52 38.19,107.06 29.42,107.06 26.92,104.56 26.92,93.77 24.34,91.19 7.83,91.19 4.7,88.05 4.7,69.47 SCL.1 | OLED1.SCL 38.73,106.52
  Bottom 0.305: IC2.7 42.47,100.02 v43.3,100.85
SDA  (via drill 0.35)
  Top 0.305: v42.55,101.6 36.83,101.6 | 36.83,101.6 35.01,101.6 30.69,105.92 29,105.92 27.43,104.35 27.43,93.56 24.55,90.68 8.04,90.68 5.21,87.84 5.21,67.44 SDA.1 | 36.83,101.6 36.83,105.64 v37.47,106.28
  Bottom 0.305: IC2.6 41.62,100.67 v42.55,101.6 | v37.47,106.28 39.22,108.03 39.23,108.03 40.42,109.22 OLED1.SDA

### Text on the board
tNames: Rob Ellis 2022